# Altium schematic sheet Digital.SchDoc
size 406 x 304 mm; SheetNumber: 3; SheetTotal: 4
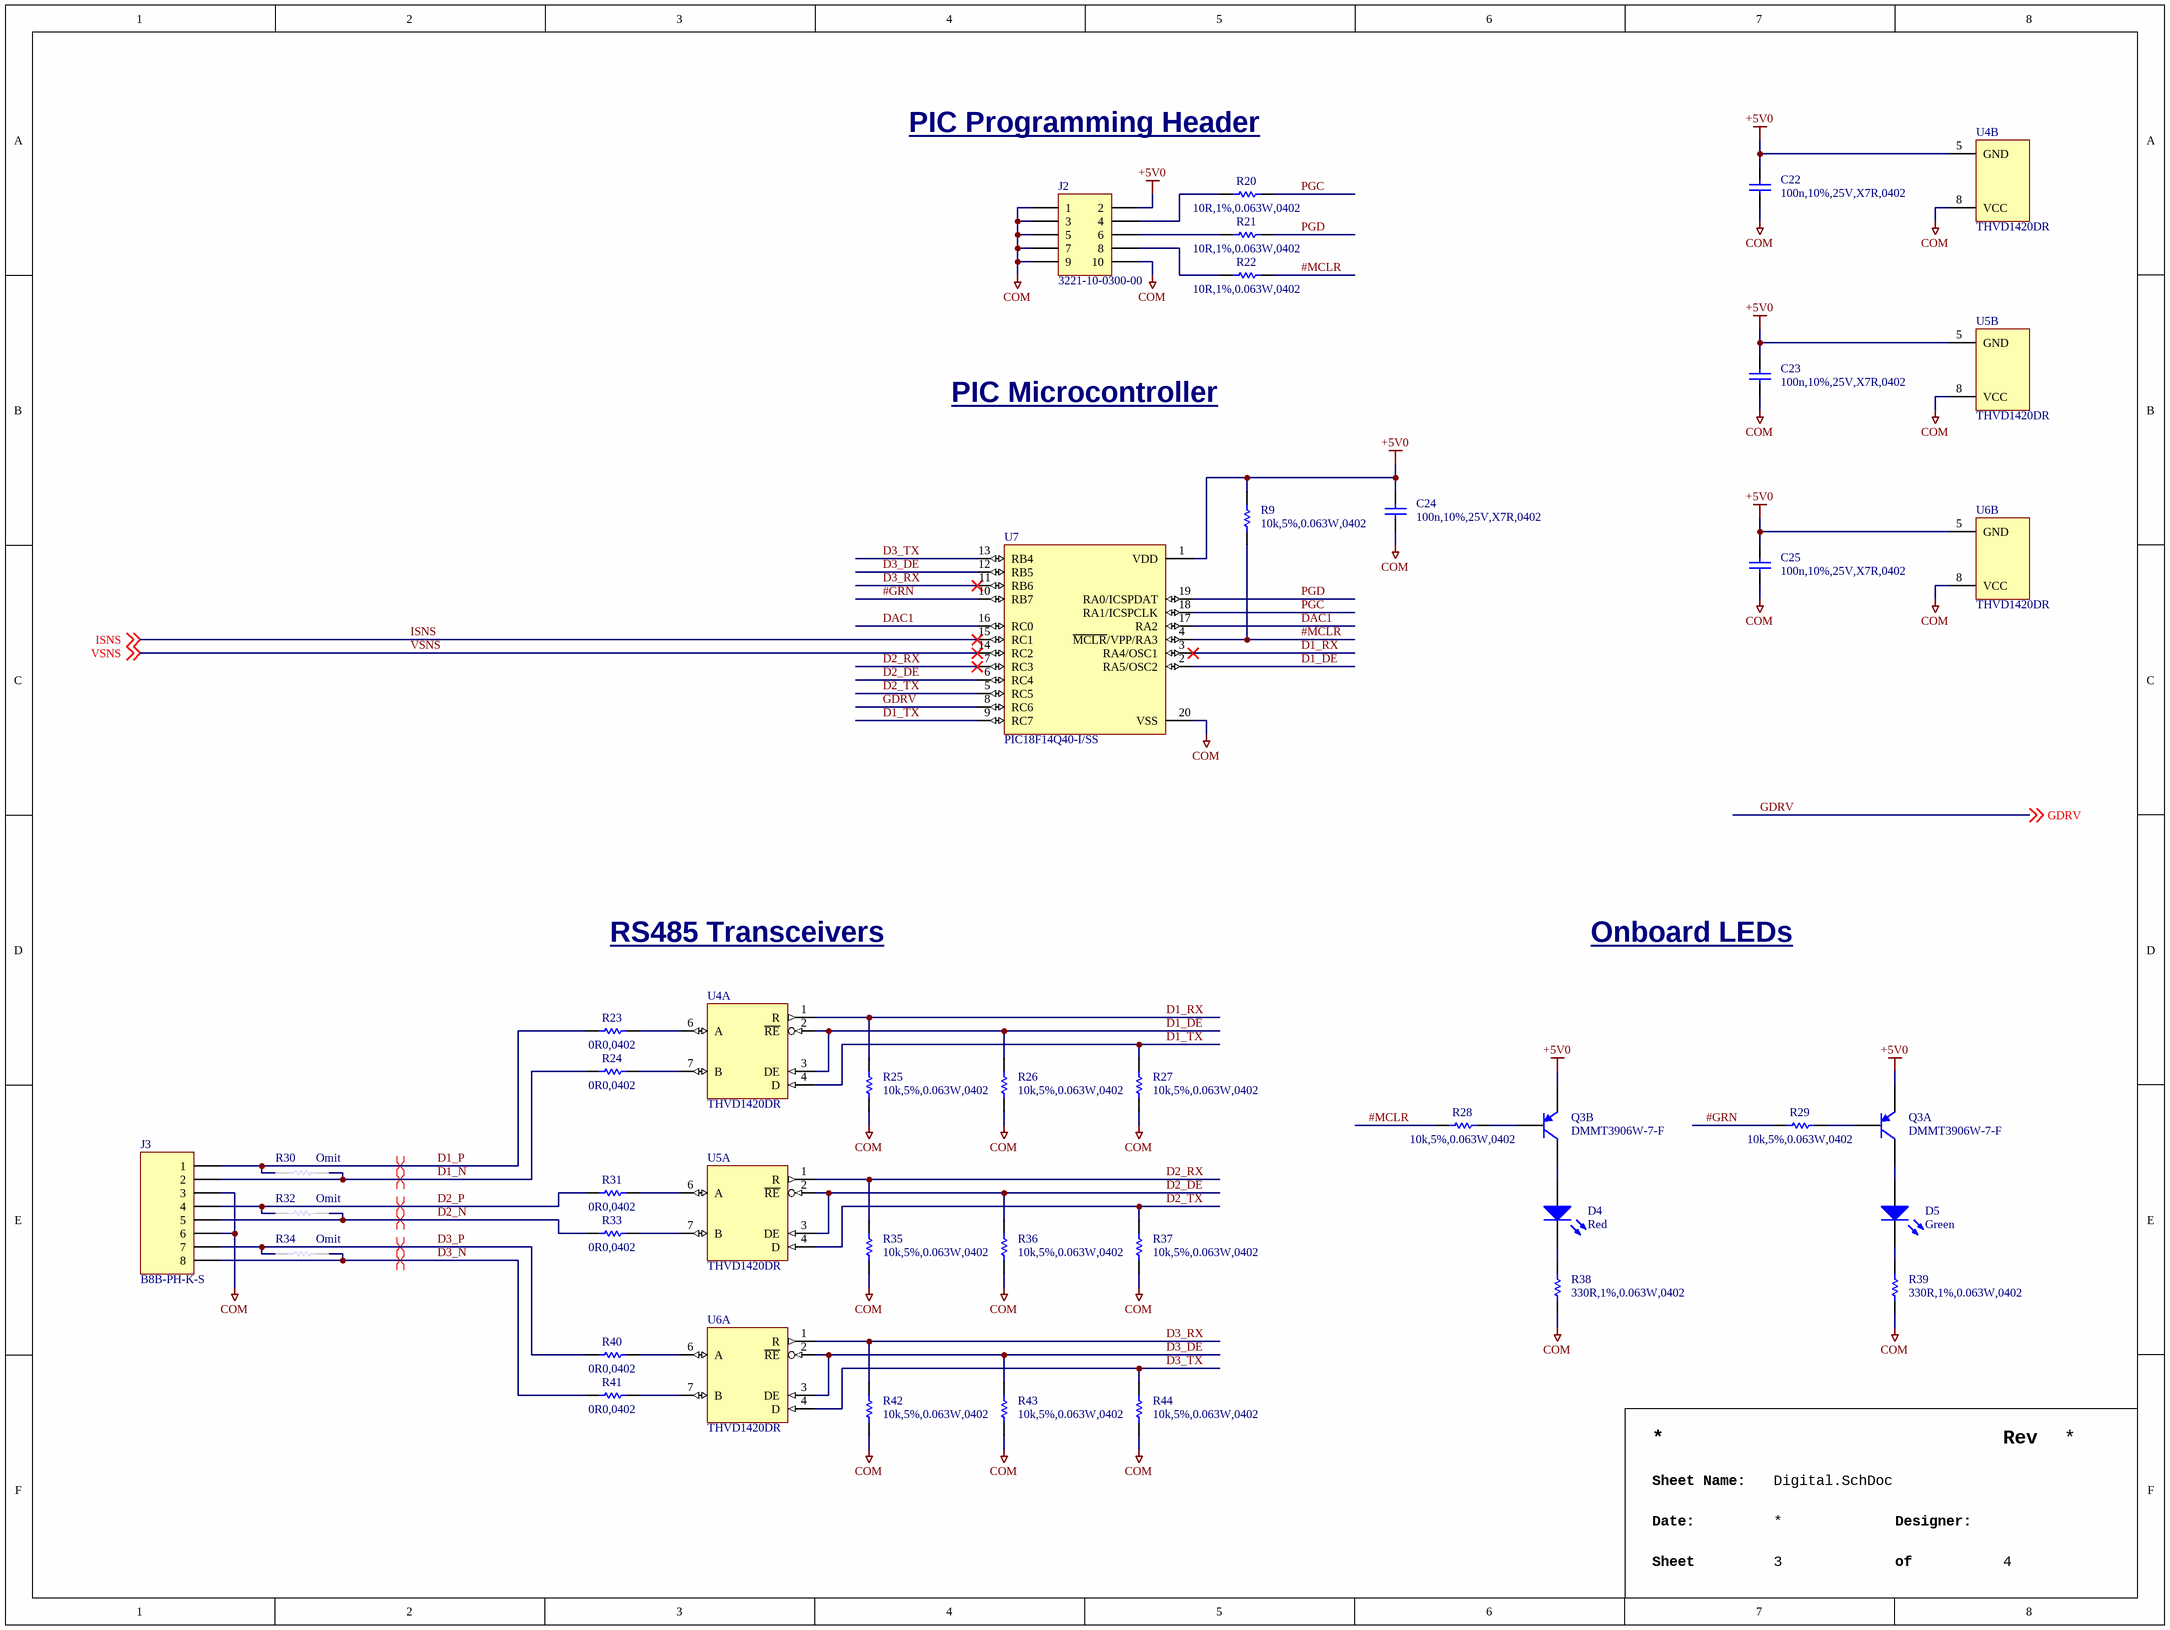
[diagram p0: Digital.SchDoc]

## Parts
C22  100n,10%,25V,X7R,0402  [CAPC1005X06N]
C23  100n,10%,25V,X7R,0402  [CAPC1005X06N]
C24  100n,10%,25V,X7R,0402  [CAPC1005X06N]
C25  100n,10%,25V,X7R,0402  [CAPC1005X06N]
D4  Red  [LITE-ON_LTST-C190KRKT]
D5  Green  [LITE-ON_LTST-C190KGKT]
J2  3221-10-0300-00  [CNC Tech_3221-10-0300-00]
J3  B8B-PH-K-S  [JST_B8B-PH-K-S]
Q3  DMMT3906W-7-F  [DIODES_SOT363]  (parts A,B of 2)
R9  10k,5%,0.063W,0402  [RESC1005X04N]
R20  10R,1%,0.063W,0402  [RESC1005X04N]
R21  10R,1%,0.063W,0402  [RESC1005X04N]
R22  10R,1%,0.063W,0402  [RESC1005X04N]
R23  0R0,0402  [RESC1005X04N]
R24  0R0,0402  [RESC1005X04N]
R25  10k,5%,0.063W,0402  [RESC1005X04N]
R26  10k,5%,0.063W,0402  [RESC1005X04N]
R27  10k,5%,0.063W,0402  [RESC1005X04N]
R28  10k,5%,0.063W,0402  [RESC1005X04N]
R29  10k,5%,0.063W,0402  [RESC1005X04N]
R30  Omit  [RESC3216X06N]  (no BOM)
R31  0R0,0402  [RESC1005X04N]
R32  Omit  [RESC3216X06N]  (no BOM)
R33  0R0,0402  [RESC1005X04N]
R34  Omit  [RESC3216X06N]  (no BOM)
R35  10k,5%,0.063W,0402  [RESC1005X04N]
R36  10k,5%,0.063W,0402  [RESC1005X04N]
R37  10k,5%,0.063W,0402  [RESC1005X04N]
R38  330R,1%,0.063W,0402  [RESC1005X04N]
R39  330R,1%,0.063W,0402  [RESC1005X04N]
R40  0R0,0402  [RESC1005X04N]
R41  0R0,0402  [RESC1005X04N]
R42  10k,5%,0.063W,0402  [RESC1005X04N]
R43  10k,5%,0.063W,0402  [RESC1005X04N]
R44  10k,5%,0.063W,0402  [RESC1005X04N]
U4  THVD1420DR  [TEXASINSTRUMENTS_PKG_D0008A]  (parts A,B of 2)
U5  THVD1420DR  [TEXASINSTRUMENTS_PKG_D0008A]  (parts A,B of 2)
U6  THVD1420DR  [TEXASINSTRUMENTS_PKG_D0008A]  (parts A,B of 2)
U7  PIC18F14Q40-I/SS  [MICROCHIP_PKG_SSOP20(C04-2072B)]

## Nets
+5V0: C22.2 C23.2 C24.2 C25.2 J2.2 Q3.4(E1) Q3.5(E2) R9.2 U4.5(GND) U5.5(GND) U6.5(GND) U7.1(VDD)
COM: C22.1 C23.1 C24.1 C25.1 J2.1 J2.3 J2.5 J2.7 J2.9 J2.10 J3.3 J3.6 R25.2 R26.2 R27.2 R35.2 R36.2 R37.2 R38.1 R39.1 R42.2 R43.2 R44.2 U4.8(VCC) U5.8(VCC) U6.8(VCC) U7.20(VSS)
#GRN: R29.2 U7.10(RB7)
#MCLR: R9.1 R22.2 R28.2 U7.4(~{MCLR}/VPP/RA3)
D1_DE: R26.1 U4.2(~{RE}) U4.3(DE) U7.2(RA5/OSC2)
D1_N: J3.2 R24.1 R30.1
D1_P: J3.1 R23.1 R30.2
D1_RX: R25.1 U4.1(R) U7.3(RA4/OSC1)
D1_TX: R27.1 U4.4(D) U7.9(RC7)
D2_DE: R36.1 U5.2(~{RE}) U5.3(DE) U7.6(RC4)
D2_N: J3.5 R32.1 R33.1
D2_P: J3.4 R31.1 R32.2
D2_RX: R35.1 U5.1(R) U7.7(RC3)
D2_TX: R37.1 U5.4(D) U7.5(RC5)
D3_DE: R43.1 U6.2(~{RE}) U6.3(DE) U7.12(RB5)
D3_N: J3.8 R34.1 R41.1
D3_P: J3.7 R34.2 R40.1
D3_RX: R42.1 U6.1(R) U7.11(RB6)
D3_TX: R44.1 U6.4(D) U7.13(RB4)
DAC1: U7.16(RC0) U7.17(RA2)
GDRV: U7.8(RC6) ; off-sheet GDRV
ISNS: U7.15(RC1) ; off-sheet ISNS
PGC: R20.2 U7.18(RA1/ICSPCLK)
PGD: R21.2 U7.19(RA0/ICSPDAT)
VSNS: U7.14(RC2) ; off-sheet VSNS
NetD4_A: D4.A Q3.6(C2)
NetD4_C: D4.C R38.2
NetD5_A: D5.A Q3.3(C1)
NetD5_C: D5.C R39.2
NetJ2_4: J2.4 R20.1
NetJ2_6: J2.6 R21.1
NetJ2_8: J2.8 R22.1
NetQ3_1: Q3.1(B2) R28.1
NetQ3_2: Q3.2(B1) R29.1
NetR23_2: R23.2 U4.6(A)
NetR24_2: R24.2 U4.7(B)
NetR31_2: R31.2 U5.6(A)
NetR33_2: R33.2 U5.7(B)
NetR40_2: R40.2 U6.6(A)
NetR41_2: R41.2 U6.7(B)

## Layout directives
differential pair: D1_N, D1_P, D2_N, D2_P, D3_N, D3_P

## Notes on the sheet
- PIC Programming Header
- PIC Microcontroller
- RS485 Transceivers
- Onboard LEDs
- Rev
- Sheet Name:
- Date:
- Sheet
- Designer:
- of

## Library data of the parts
C22-C25 = CAP,Cer,100nF,10%,25V,X7R,0402: 0.1ï¿½F ï¿½10% 25V Ceramic Capacitor X7R 0402 (1005 Metric); Manufacturer 1: Murata Electronics; Manufacturer 1 Part Number: GRM155R71E104KE14J; Vendor 1 Part Number: 490-14603-1-ND; Vendor 1: DigiKey; Value: 100nF; Part Name: CAP,Cer,100nF,10%,25V,X7R,0402; CreatedBy: Judd Foster; HelpURL: https://search.murata.co.jp/Ceramy/image/img/A01X/G101/ENG/GRM155R71E104KE14-01.pdf
D4 = LED,Red,SMD,0603: Red 631nm LED Indication - Discrete 2V 0603 (1608 Metric); Manufacturer 1: Lite-On Inc.; Manufacturer 1 Part Number: LTST-C190KRKT; Vendor 1 Part Number: 160-1436-1-ND; Vendor 1: Digikey; Part Name: LED,Red,SMD,0603; CreatedBy: Judd Foster; HelpURL: https://optoelectronics.liteon.com/upload/download/DS-22-99-0151/LTST-C190KRKT.pdf; Value: Red
D5 = LED,Green,SMD,0603: Green 571nm LED Indication - Discrete 2V 0603 (1608 Metric); Manufacturer 1: Lite-On Inc.; Manufacturer 1 Part Number: LTST-C190KGKT; Vendor 1 Part Number: 160-1435-1-ND; Vendor 1: Digikey; Part Name: LED,Green,SMD,0603; CreatedBy: Judd Foster; HelpURL: https://optoelectronics.liteon.com/upload/download/DS22-2000-074/LTST-C190KGKT.PDF; Value: Green
J2 = Term,Header,5x2 Pin,Shroud,1.27mm,SMD: Connector Header Surface Mount 10 position 0.050" (1.27mm); Manufacturer 1: CNC Tech; Vendor 1 Part Number: 1175-1735-ND; Vendor 1: Digikey; Part Name: Term,Header,5x2 Pin,Shroud,1.27mm,SMD; CreatedBy: Judd Foster; HelpURL: http://www.cnctech.us/pdfs/3221-XX-0300-00_.pdf; Manufacturer 1 Part Number: 3221-10-0300-00
J3 = CONN,JST,8 Pin,2mm,Vert,Thru: Connector Header Through Hole 8 position 0.079" (2.00mm); Manufacturer 1: JST Sales America Inc.; Vendor 1 Part Number: 455-1710-ND; Vendor 1: DigiKey; Part Name: CONN,JST,8 Pin,2mm,Vert,Thru; CreatedBy: Judd Foster; HelpURL: https://www.jst-mfg.com/product/pdf/eng/ePH.pdf; Manufacturer 1 Part Number: B8B-PH-K-S
Q3 = Trans,PNP,Dual,40V,200mA,SOT363: Bipolar (BJT) Transistor Array 2 PNP (Dual) Matched Pair 40V 200mA 250MHz 200mW Surface Mount SOT-363; Manufacturer 1: Diodes Incorporated; Vendor 1 Part Number: DMMT3906W-FDICT-ND; Vendor 1: Digikey; Part Name: Trans,PNP,Dual,40V,200mA,SOT363; CreatedBy: Judd Foster; HelpURL: https://www.diodes.com/assets/Datasheets/ds30312.pdf; Manufacturer 1 Part Number: DMMT3906W-7-F
R9 R25-R29 R35-R37 R42-R44 = RES,10k,5%,0.063W,0402: 10 kOhms ï¿½5% 0.063W, 1/16W Chip Resistor 0402 (1005 Metric) Automotive AEC-Q200 Thick Film; Manufacturer 1: Stackpole Electronics Inc; Manufacturer 1 Part Number: RMCF0402JT10K0; Vendor 1 Part Number: RMCF0402JT10K0CT-ND; Vendor 1: DIgikey; Part Name: RES,10k,5%,0.063W,0402; CreatedBy: Judd Foster; HelpURL: https://www.seielect.com/catalog/sei-rmcf_rmcp.pdf; Value: 10k
R20-R22 = RES,10R,1%,0.063W,0402: 10 Ohms ï¿½1% 0.063W, 1/16W Chip Resistor 0402 (1005 Metric) Automotive AEC-Q200 Thick Film; Manufacturer 1: Panasonic Electronic Components; Manufacturer 1 Part Number: ERJ-2RKF10R0X; Vendor 1 Part Number: P10.0LCT-ND; Vendor 1: Digikey; Part Name: RES,10R,1%,0.063W,0402; CreatedBy: Judd Foster; HelpURL: https://industrial.panasonic.com/cdbs/www-data/pdf/RDA0000/AOA0000C304.pdf; Value: 10R
R23 R24 R31 R33 R40 R41 = RES,0R0,0402: 0 Ohms Jumper 0.1W, 1/10W Chip Resistor 0402 (1005 Metric) Automotive AEC-Q200 Thick Film; Manufacturer 1: Panasonic Electronic Components; Manufacturer 1 Part Number: ERJ-2GE0R00X; Vendor 1 Part Number: P0.0JCT-ND; Vendor 1: Digikey; Value: 0R; Part Name: RES,0R0,0402; CreatedBy: Judd Foster; HelpURL: https://industrial.panasonic.com/cdbs/www-data/pdf/RDA0000/AOA0000C301.pdf
R30 R32 R34 = RES,Omit,1206: Part Name: RES,Omit,1206; CreatedBy: Judd Foster; HelpURL: N/A; Manufacturer 1: N/A; Manufacturer 1 Part Number: N/A; Vendor 1: N/A; Vendor 1 Part Number: N/A; Value: Omit
R38 R39 = RES,330R,1%,0.063W,0402: 330 Ohms Â±1% 0.063W, 1/16W Chip Resistor 0402 (1005 Metric) Moisture Resistant Thick Film; Manufacturer 1: YAGEO; Manufacturer 1 Part Number: RC0402FR-07330RL; Vendor 1 Part Number: 311-330LRCT-ND; Vendor 1: DigiKey; Part Name: RES,330R,1%,0.063W,0402; CreatedBy: Judd Foster; HelpURL: https://www.yageo.com/upload/media/product/products/datasheet/rchip/PYu-RC_Group_51_RoHS_L_12.pdf; Value: 330R
U4-U6 = THVD1420DR: 1/1 Transceiver Half RS422, RS485 8-SOIC; Manufacturer 1: Texas Instruments; Vendor 1 Part Number: 296-THVD1420DRCT-ND; Vendor 1: DigiKey; Part Name: THVD1420DR; CreatedBy: Judd Foster; HelpURL: https://www.ti.com/lit/ds/symlink/thvd1420.pdf?HQS=dis-dk-null-digikeymode-dsf-pf-null-wwe&ts=1735314435967; Manufacturer 1 Part Number: THVD1420DR
U7 = PIC18F14Q40-I_SS: PIC PICÂ® 18F Microcontroller IC 8-Bit 64MHz 16KB (16K x 8) FLASH 20-SSOP; Manufacturer 1: Microchip Technology; Vendor 1 Part Number: 150-PIC18F14Q40-I/SS-ND; Vendor 1: DigiKey; Part Name: PIC18F14Q40-I_SS; CreatedBy: Judd Foster; HelpURL: https://ww1.microchip.com/downloads/en/DeviceDoc/PIC18F04-05-14-15-Q40-1420-Pin-Low-Power-High-Performance-Microcontroller-With-XLP-Technology-Data-Sheet-40002236B.pdf; Manufacturer 1 Part Number: PIC18F14Q40-I/SS